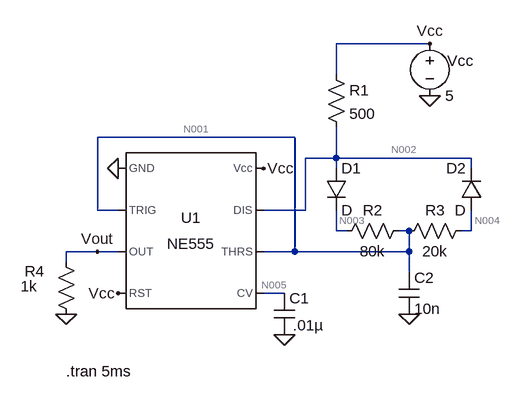
[diagram p0: schematic Controller.asc]
Controller.asc, the LTspice schematic file:
Version 4
SHEET 1 880 680
WIRE 592 -112 448 -112
WIRE 448 -64 448 -112
WIRE 384 32 80 32
WIRE 448 64 448 16
WIRE 448 64 400 64
WIRE 656 64 448 64
WIRE 448 80 448 64
WIRE 656 80 656 64
WIRE 80 144 80 32
WIRE 112 144 80 144
WIRE 400 144 400 64
WIRE 400 144 336 144
WIRE 448 176 448 144
WIRE 464 176 448 176
WIRE 560 176 544 176
WIRE 656 176 656 144
WIRE 656 176 640 176
WIRE 80 208 32 208
WIRE 112 208 80 208
WIRE 384 208 384 32
WIRE 384 208 336 208
WIRE 560 208 560 176
WIRE 560 208 384 208
WIRE 32 224 32 208
WIRE 560 240 560 208
WIRE 368 272 336 272
FLAG 112 80 0
FLAG 592 -32 0
FLAG 592 -112 Vcc
FLAG 112 272 Vcc
FLAG 336 80 Vcc
FLAG 368 336 0
FLAG 32 304 0
FLAG 560 304 0
FLAG 80 208 Vout
SYMBOL Misc\\NE555 224 176 R0
SYMATTR InstName U1
SYMBOL voltage 592 -128 R0
WINDOW 123 0 0 Left 0
WINDOW 39 0 0 Left 0
WINDOW 0 27 42 Left 2
SYMATTR InstName Vcc
SYMATTR Value 5
SYMBOL cap 352 272 R0
WINDOW 3 29 49 Left 2
SYMATTR Value .01µ
SYMATTR InstName C1
SYMBOL res 16 208 R0
WINDOW 0 -48 30 Left 2
WINDOW 3 -54 53 Left 2
SYMATTR InstName R4
SYMATTR Value 1k
SYMBOL cap 544 240 R0
SYMATTR InstName C2
SYMATTR Value 10n
SYMBOL res 560 160 R90
WINDOW 0 0 56 VBottom 2
WINDOW 3 32 56 VTop 2
SYMATTR InstName R2
SYMATTR Value 80k
SYMBOL res 656 160 R90
WINDOW 0 0 56 VBottom 2
WINDOW 3 32 56 VTop 2
SYMATTR InstName R3
SYMATTR Value 20k
SYMBOL res 432 -80 R0
SYMATTR InstName R1
SYMATTR Value 500
SYMBOL diode 432 80 R0
SYMATTR InstName D1
SYMBOL diode 672 144 R180
WINDOW 0 24 64 Left 2
WINDOW 3 24 0 Left 2
SYMATTR InstName D2
TEXT 32 392 Left 2 !.tran 5ms

The netlist it stands for:
* Controller.asc
XU1 0 N001 Vout Vcc N005 N001 N002 Vcc NE555  ; pins GND TRIG OUT RST CV THRS DIS Vcc
Vcc Vcc 0 5
C1 N005 0 .01µ
R4 Vout 0 1k
C2 N001 0 10n
R2 N001 N003 80k
R3 N004 N001 20k
R1 Vcc N002 500
D1 N002 N003 D
D2 N004 N002 D
.model D D
.lib standard.dio
.tran 5ms
.lib NE555.sub
.backanno
.end

* Results of the author's LTspice run, read from the files saved beside the schematic
* Operating Point, zero values left out:
*   V(n001) = 4.644 V
*   V(n005) = 3.333 V
*   V(vcc) = 5 V
*   V(n002) = 5 V
*   V(vout) = 4.97 V
*   V(n003) = 4.645 V
*   V(n004) = 4.644 V
*   I(D1) = 9.289 nA
*   I(R1) = 15.96 nA
*   I(R2) = -9.287 nA
*   I(R4) = 4.97 mA
*   I(Vcc) = -6.581 mA
*   Ix(u1:1) = -1.611 mA
*   Ix(u1:2) = 4.644 nA
*   Ix(u1:3) = -4.97 mA
*   Ix(u1:4) = 22.67 µA
*   Ix(u1:6) = 4.644 nA
*   Ix(u1:7) = 6.672 nA
*   Ix(u1:8) = 6.558 mA
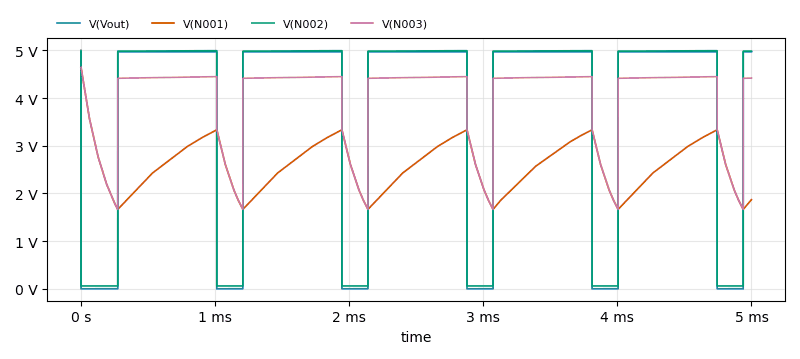
[diagram p1: Transient Analysis of Controller.asc, plotted from the saved traces]
* Transient Analysis, 1 run:
*   V(Vout): min 29.82 µV, max 4.972 V, average 3.732 V, rms 4.307 V, last 4.97 V
*   V(N001): min 1.665 V, max 4.644 V, average 2.569 V, rms 2.633 V, last 1.869 V
*   V(N002): min 59.59 mV, max 5 V, average 3.761 V, rms 4.323 V, last 4.984 V
*   V(N003): min 1.665 V, max 4.645 V, average 3.947 V, rms 4.049 V, last 4.418 V